# EAGLE design Homefi_10 (EAGLE 7.1.0)
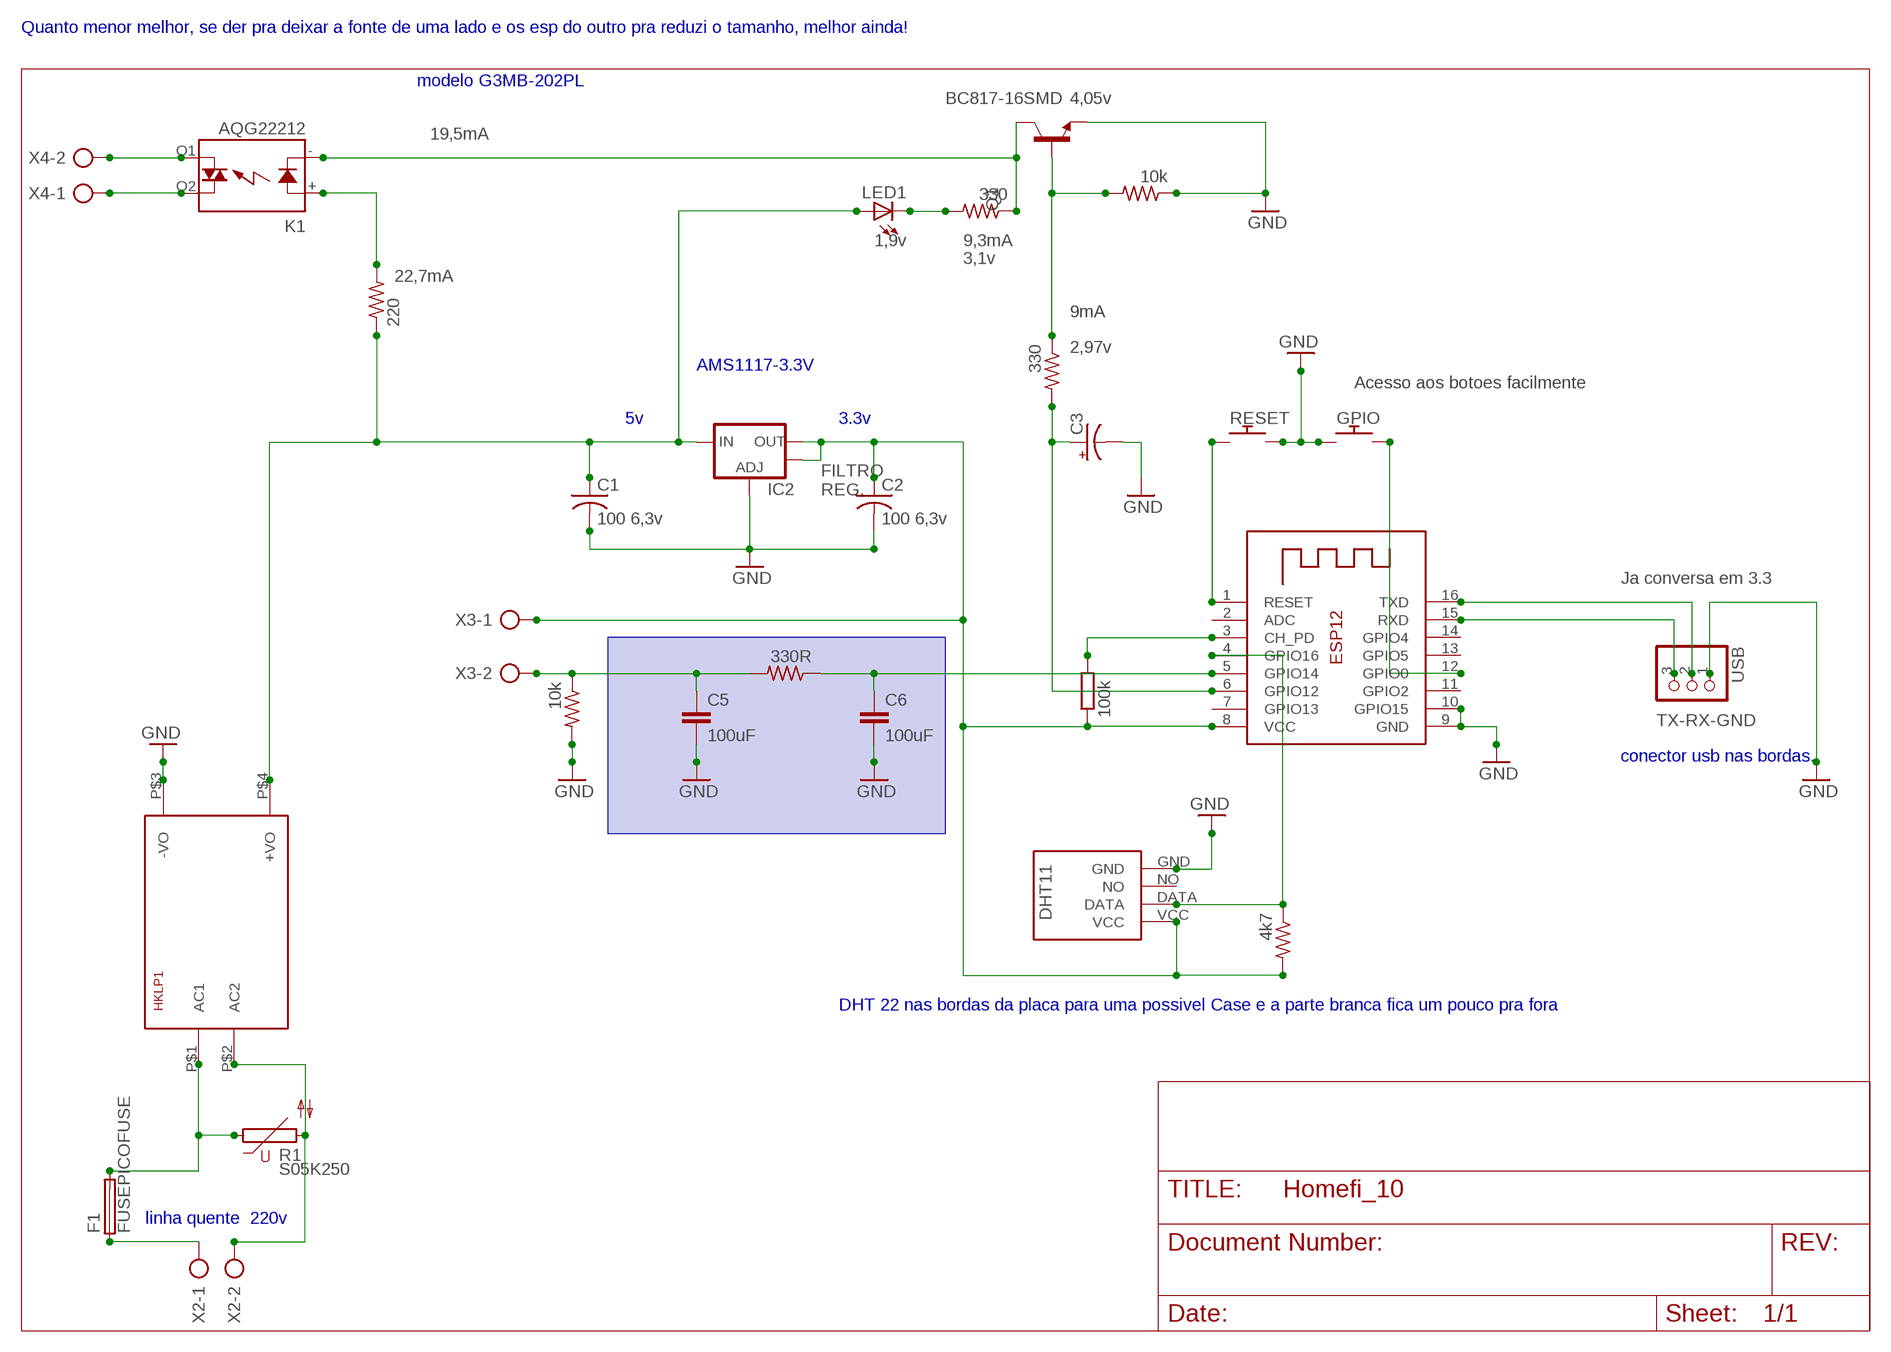
[diagram p0: schematic, sheet 1]

## Parts
1  10k  R-US_M0805  [M0805]
2  10k  R-US_M0805  [M0805]
3  100k  R-EU_M0805  [M0805]
4  330R  R-US_M0805  [M0805]
5  330  R-US_M0805  [M0805]
6  220  R-US_M0805  [M0805]
7  330  R-US_M0805  [M0805]
8  4k7  R-US_M0805  [M0805]
C1  100 6,3v  C-USC0805  [C0805]
C2  100 6,3v  C-USC0805  [C0805]
C3  CPOL-US153CLV-0605  [153CLV-0605]
C5  100uF  C-EUC0805  [C0805]
C6  100uF  C-EUC0805  [C0805]
F1  FUSEPICOFUSE  [PICOFUSE]
GPIO  GPIO  SWITCH_PUSHBUTTONEVQ-PE  [TACT_PANA-EVQ]
HKLP1  HKLPM01  [HKLPM01]
IC2  V_REG_LM1117SOT223  [SOT223]
K1  AQG22212  [AQG]
LED1  LEDCHIPLED_0805  [CHIPLED_0805]
Q1  BC817-16SMD  [SOT23-BEC]
R1  S05K250  [S05K250]
RESET  RESET  SWITCH_PUSHBUTTONEVQ-PE  [TACT_PANA-EVQ]
U$1  DHT11-PION.  [DHT11-PION.]
USB  PINHD-1X3  [1X03]
X2  AK500/2  [AK500/2]
X3  AK500/2  [AK500/2]
X4  AK500/2  [AK500/2]
X5  ESP-12  [ESP-12]

## Nets
2N3904: 5.1 K1.-(K) Q1.C
5V: 6.1 C1.1 HKLP1.P$4(+VO) IC2.3(IN) LED1.A
GND: 1.1 2.2 C1.2 C2.2 C3.- C5.2 C6.2 GPIO.P$1 HKLP1.P$3(-VO) IC2.1(ADJ) Q1.E RESET.P$2 U$1.GND USB.1 X5.9(GND) X5.10(GPIO15)
N$1: K1.O1(DS2) X4.2
N$2: 3.1 8.2 C2.1 IC2.2(OUT) IC2.4(OUT) U$1.VCC X3.1 X5.8(VCC)
N$3: 5.2 LED1.C
N$9: K1.O2(DS1) X4.1
N$10: 6.2 K1.+(A)
N$12: USB.3 X5.15(RXD)
N$15: RESET.P$1 X5.1(RESET)
N$16: F1.1 X2.1
N$17: 1.2 7.1 Q1.B
N$19: F1.2 HKLP1.P$1(AC1) R1.1
N$20: 4.1 C6.1 X5.5(GPIO14)
N$23: 2.1 4.2 C5.1 X3.2
N$24: 3.2 X5.3(CH_PD)
N$25: 7.2 C3.+ X5.6(GPIO12)
N$35: HKLP1.P$2(AC2) R1.2 X2.2
N$41: 8.1 U$1.DATA X5.4(GPIO16)
N$45: GPIO.P$2 X5.12(GPIO0)
N$48: USB.2 X5.16(TXD)
Unconnected: U$1.NO X5.2(ADC) X5.7(GPIO13) X5.11(GPIO2) X5.13(GPIO5) X5.14(GPIO4)

## Notes on the sheet
- Quanto menor melhor, se der pra deixar a fonte de uma lado e os esp do outro pra reduzi o tamanho, melhor ainda!
- modelo G3MB-202PL
- 4,05v
- 19,5mA
- 1,9v | 9,3mA
- 3,1v
- 22,7mA
- 9mA
- 2,97v
- AMS1117-3.3V
- Acesso aos botoes facilmente
- 5v | 3.3v
- FILTRO
  REG.
- Ja conversa em 3.3
- TX-RX-GND
- conector usb nas bordas.
- DHT 22 nas bordas da placa para uma possivel Case e a parte branca fica um pouco pra fora
- linha quente  220v

## Library data of the parts
1 2 4-8 = adafruit:R-US_: RESISTOR, American symbol
3 = rcl:R-EU_: RESISTOR, European symbol
C1 C2 = adafruit:C-US: CAPACITOR, American symbol
C3 = rcl:CPOL-US: POLARIZED CAPACITOR, American symbol
C5 C6 = rcl:C-EU: CAPACITOR, European symbol
F1 = fuse:FUSE: Fuse; OC_FARNELL: unknown; OC_NEWARK: unknown
GPIO RESET = adafruit:SWITCH_PUSHBUTTON: Buttons SOFTTOUCHSMD_SJ - Soft touch temporary push button (Super Junk Akihabara) Compatible with SKPMANE010 [Mouser: 688-SKPMAN] C&K_KSS = Digikey: KSS221GLFS
HKLP1 = HKLPM01:HKLPM01
IC2 = SparkFun-PowerIC:V_REG_LM1117: Voltage Regulator LM1117 Standard adjustable voltage regulator but in SMD form. Spark Fun Electronics SKU : COM-00595
K1 = relay-omron:AQG*: SOLID STATE RELAY NAiS Zero-cross, Non zero-cross Source: http://www.mew-europe.com/.. en_ds_61611_0000.pdf; MPN: AQG22212; OC_FARNELL: unknown; OC_NEWARK: 11N2588
LED1 = adafruit:LED: LED OSRAM: - CHIPLED LG R971, LG N971, LY N971, LG Q971, LY Q971, LO R971, LY R971 LH N974, LH R974 LS Q976, LO Q976, LY Q976 LO Q996 - Hyper CHIPLED LW Q18S LB Q993, LB Q99A, LB R99A - SideLED LS A670, LO A670, LY A670, LG A670, LP A670 LB A673, LV A673, LT A673, LW A673 LH A674 LY A675 LS A676, LA A676, LO A676, LY A676, LW A676 LS A679, LY A679, LG A679 - Hyper Micro SIDELED® LS Y876, LA Y876, LO Y876, LY Y876 LT Y87S - SmartLED LW L88C, LW L88S LB L89C, LB L89S, LG L890 LS L89K, LO L89K, LY L89K LS L896, LA L896, LO L896, LY L896 - TOPLED LS T670, LO T670, LY T670, LG T670, LP T670 LSG T670, LSP T670, LSY T670, LOP T670, LYG T670 LG T671, LOG T671, LSG T671 LB T673, LV T673, LT T673, LW T673 LH T674 LS T676, LA T676, LO T676, LY T676, LB T676, LH T676, LSB T676, LW T676 LB T67C, LV T67C, LT T67C, LS T67K, LO T67K, LY T67K, LW E67C LS E67B, LA E67B, LO E67B, LY E67B, LB E67C, LV E67C, LT E67C LW T67C LS T679, LY T679, LG T679 LS T770, LO T770, LY T770, LG T770, LP T770 LB T773, LV T773, LT T773, LW T773 LH T774 LS E675, LA E675, LY E675, LS T675 LS T776, LA T776, LO T776, LY T776, LB T776 LHGB T686 LT T68C, LB T68C - Hyper Mini TOPLED® LB M676 - Mini TOPLED Santana® LG M470 LS M47K, LO M47K, LY M47K Source: http://www.osram.convergy.de/
Q1 = transistor-npn:BC817*: NPN Transistor
R1 = varistor:S05K250: VARISTOR
U$1 = DHT11:DHT11-PION.: DHT11 Czujnik temperatury i wilgotności (widok pionowy)
USB = adafruit:PINHD-1X3: PIN HEADER
X2-X4 = con-ptr500:AK500/2: CONNECTOR; OC_FARNELL: unknown; OC_NEWARK: unknown
X5 = adafruit:ESP-12

## Board
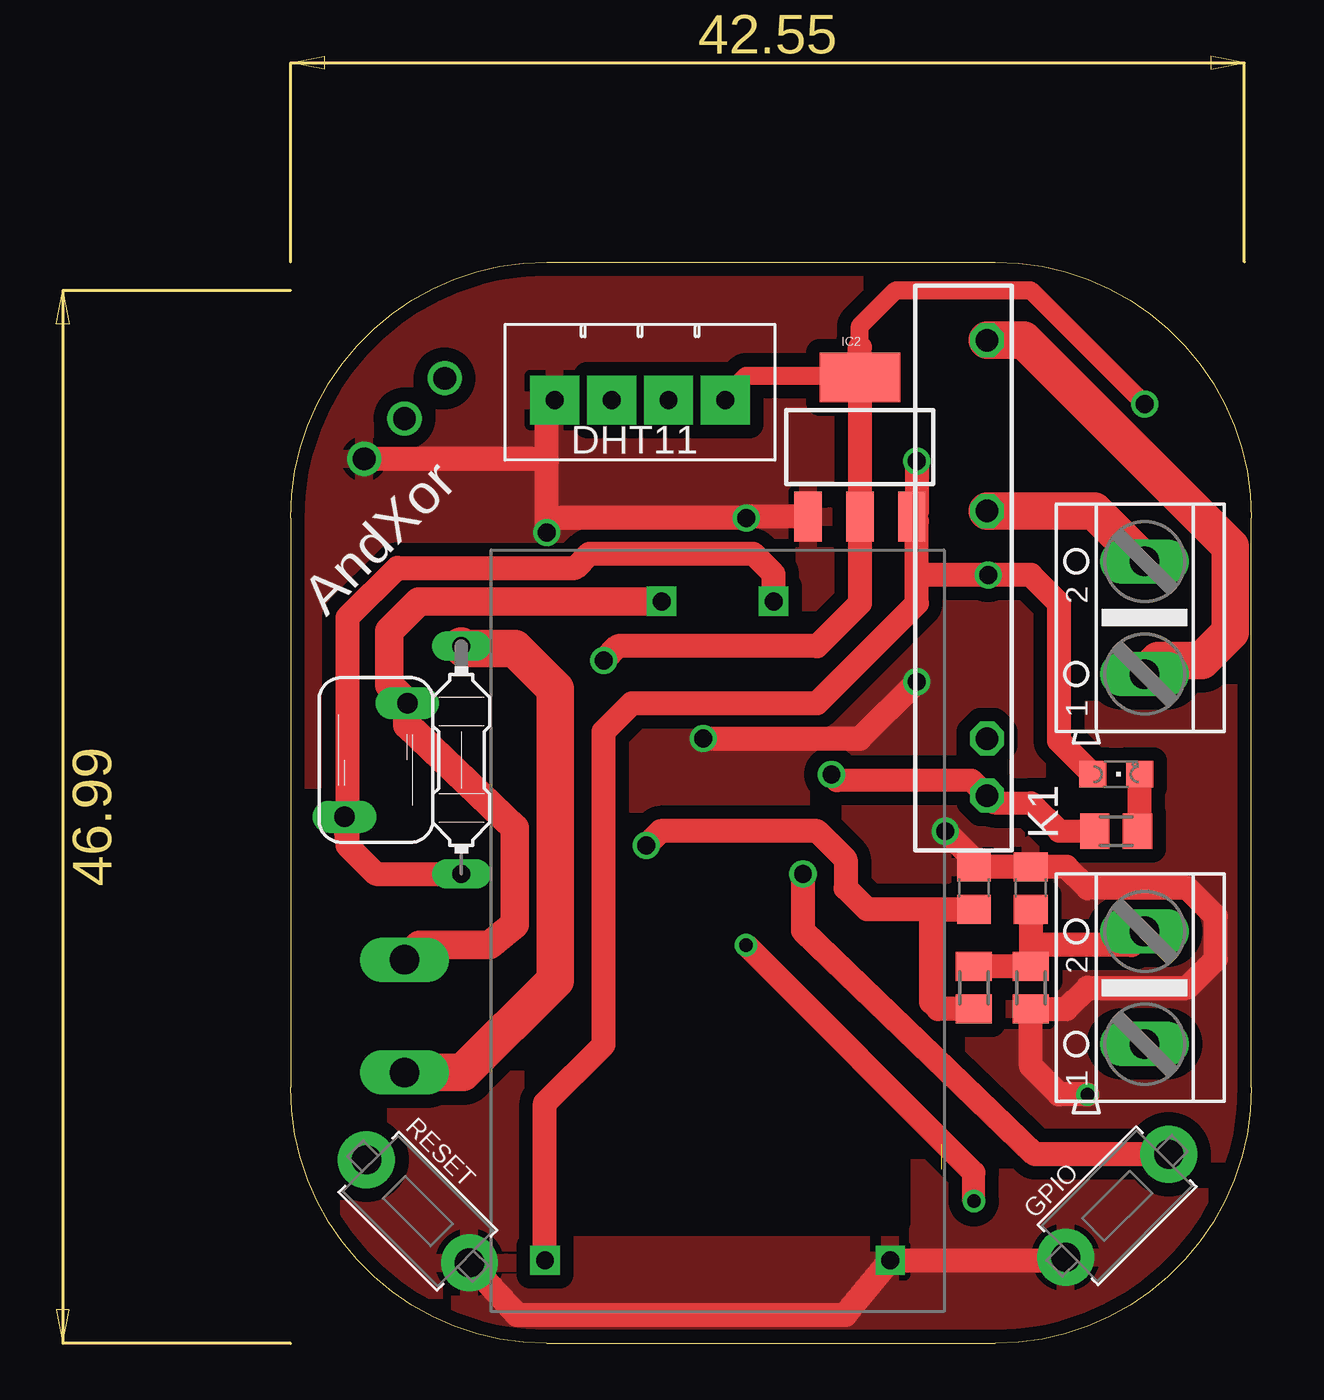
[diagram p1: board, top side]
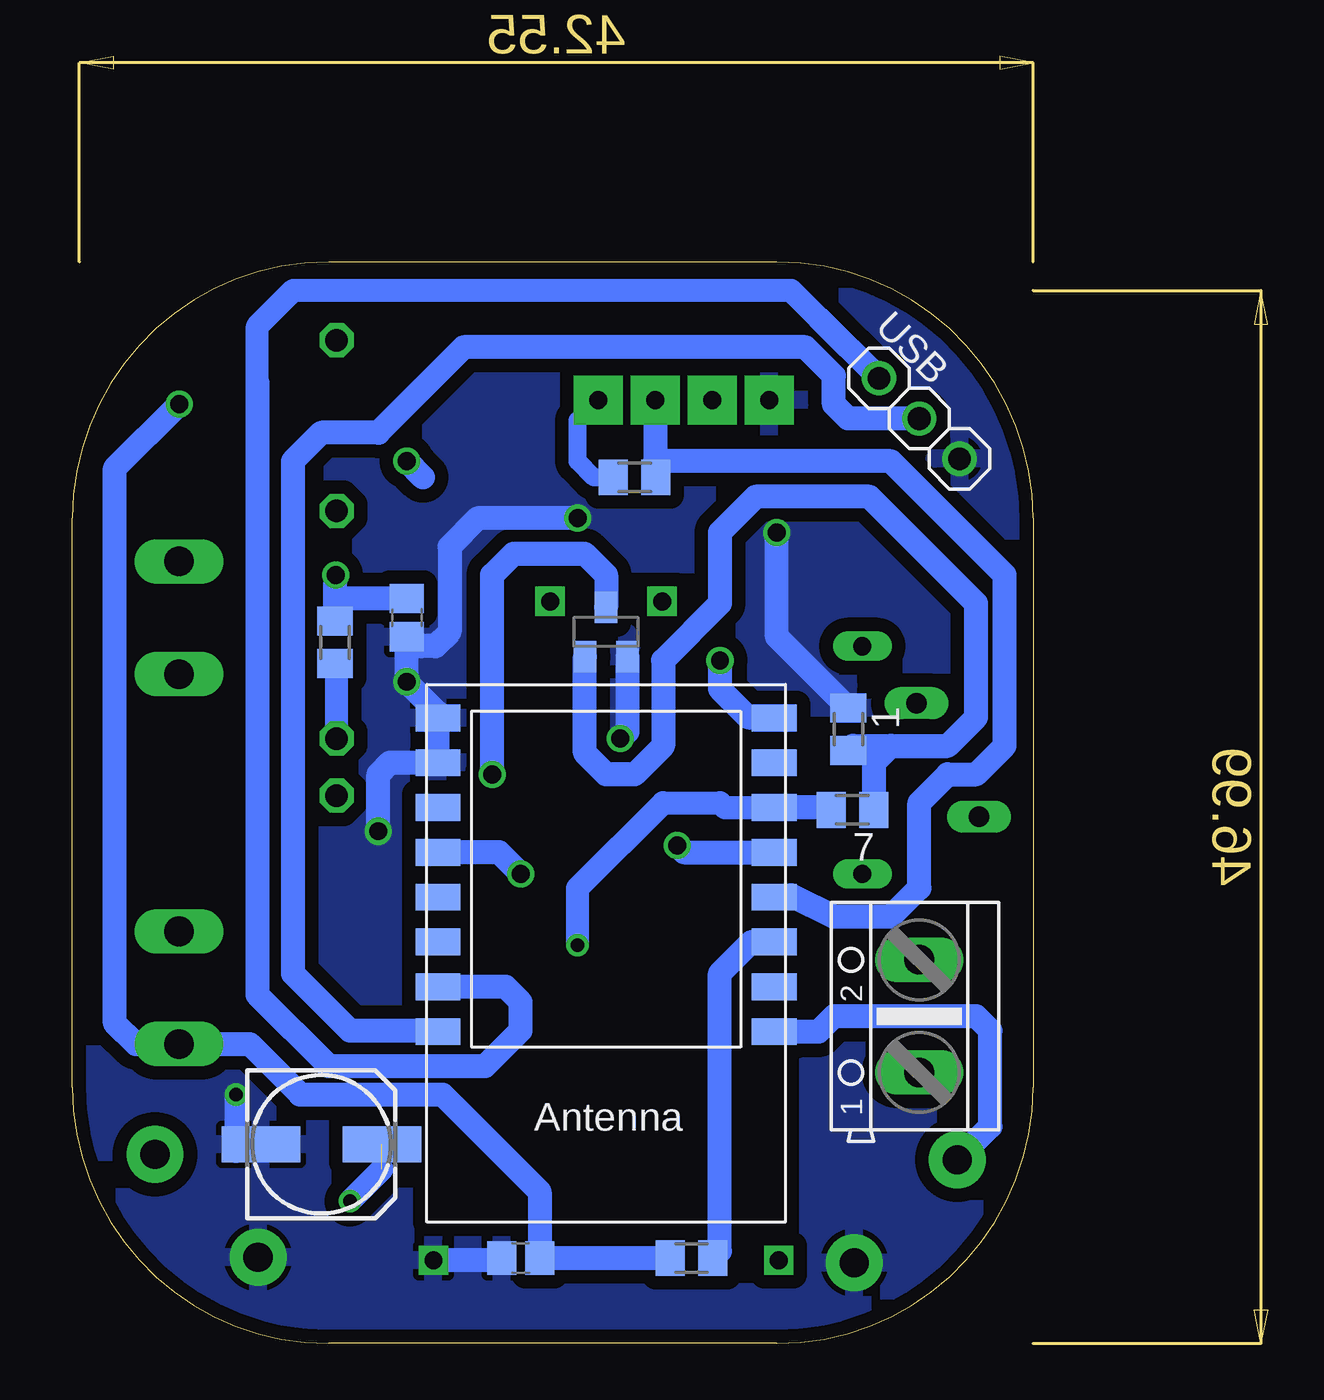
[diagram p2: board, bottom side, seen from below]

Size 42.86 x 48.26 mm. Coordinates in mm from the lower left corner, seen from the top.
Outline: 0,36.83 arc-90 11.43,48.26 31.43,48.26 arc-90 42.86,36.83 42.86,11.43 arc-90 31.43,0 11.43,0 arc-90 0,11.43 0,36.83
Copper layers (1*16): Top 0.035mm / dielectric 1.5mm / Bottom 0.035mm
Design rules "Modulo_Versão_466 (1) *": minimum track width 1mil, minimum drill 24mil, track to track 8mil, track to pad 8mil, pad to pad 8mil, via to via 0.205mm, smd to smd 8mil, copper to edge 2mil, drill to drill 4mil, minimum pad ring 10mil, minimum via ring 8mil, stop-mask expansion 4mil, vias tented up to drill 0mil, thermal gap 10mil

### Footprints (pad centres in the part's own frame; a part is rotated, then mirrored left to right if it is on the bottom)
M0805 = smd 1.3 x 1.6: 1 -0.95,0; 2 0.95,0
C0805 = smd 1.3 x 1.5: 1 -0.85,0; 2 0.85,0
153CLV-0605 = smd 3.5 x 1.6: + 2.7,0; - -2.7,0
C0805' = smd 1.3 x 1.5: 1 -0.95,0; 2 0.95,0
PICOFUSE = drill 0.813 long: 1 -5.08,0; 2 5.08,0
TACT_PANA-EVQ = drill 1.3 pad 2.54: P$1 -3.25,0; P$2 3.25,0
HKLPM01 = drill 0.8 square: P$1 -14.7,2.5; P$2 -14.7,-2.5; P$3 14.7,7.7; P$4 14.7,-7.7
SOT223 = smd 1.219 x 2.235: 1 -2.311,-3.099; 2 0,-3.099; 3 2.311,-3.099 | smd 3.6 x 2.2: 4 0,3.099
AQG = drill 1 octagon: + -7.62,0; - -10.16,0; O1 2.54,0; O2 10.16,0
CHIPLED_0805 = smd 1.2 x 1.2: A 0,-1.05; C 0,1.05
SOT23-BEC = smd 1 x 1.4: B -0.95,-1.1; C 0,1.1; E 0.95,-1.1
S05K250 = drill 0.914 long: 1 -1.397,-2.54; 2 1.397,2.54
DHT11-PION. = drill 0.8 pad 2.184 square: DATA -1.27,0.305; GND 3.81,0.305; NO 1.27,0.305; VCC -3.81,0.305
1X03 = drill 1.016: 1 -2.54,0; 2 0,0; 3 2.54,0
AK500/2 = drill 1.321 long: 1 -2.515,0; 2 2.515,0
ESP-12 = smd 2 x 1.2: 1 -7.5,4.5; 2 -7.5,2.5; 3 -7.5,0.5; 4 -7.5,-1.5; 5 -7.5,-3.5; 6 -7.5,-5.5; 7 -7.5,-7.5; 8 -7.5,-9.5; 9 7.5,-9.5; 10 7.5,-7.5; 11 7.5,-5.5; 12 7.5,-3.5; 13 7.5,-1.5; 14 7.5,0.5; 15 7.5,2.5; 16 7.5,4.5

### Placement (x,y rotation side)
1  8.24,27.41 270 bottom
2  33.02,15.88 270 top
3  15.24,3.81 0 bottom
4  30.48,15.88 90 top
5  36.83,22.86 0 top
6  31.14,31.29 270 bottom
7  8.06,23.81 180 bottom
8  17.78,38.65 180 bottom
C1  27.94,32.38 270 bottom
C2  22.86,3.81 180 bottom
C3  31.75,8.89 0 bottom
C5  100uF  [C0805']  33.02,20.32 90 top
C6  100uF  [C0805']  30.48,20.32 90 top
F1  7.62,26.04 270 top
GPIO  36.87,6.14 45 top
HKLP1  19.05,18.41 270 top
IC2  25.4,40.01 0 top
K1  31.07,34.61 90 top
LED1  36.83,25.4 270 top
Q1  19.05,31.75 0 bottom
R1  3.81,26.04 0 top
RESET  5.68,5.9 315 top
U$1  15.59,42.41 180 top
USB  5.08,41.27 135 bottom
X2  5.08,14.61 90 bottom
X3  38.1,15.88 90 top
X4  38.1,32.38 90 top
X5  19.05,18.41 180 bottom

### Tracks (layer width: path | path; a pad name or v marks a point on that pad's centre or on a via)
2N3904  (via drill 0.8)
  Top 1.016: 24.39,25.14 30.38,25.14 K1.- 31.39,24.13 33.02,24.13 34.29,22.86 5.1
  Top 1.067: 5.1 35.56,22.86 | 24.39,25.14 v24.13,25.4
  Bottom 1.067: v24.13,25.4 24.13,34.29 23.18,35.24 20,35.24 19.05,34.29 Q1.C
5V  (via drill 0.8)
  Top 1.067: HKLP1.P$4 11.35,10.71 13.97,13.34 13.97,27.3 15.24,28.57 23.5,28.57 27.94,33.02 27.94,34.29 | 27.94,34.29 27.94,36.68 IC2.3 27.94,37.13 v27.94,39.37 | LED1.A 34.29,26.89 34.29,33.02 33.02,34.29 v31.11,34.29 27.94,34.29
  Bottom 1.067: 27.22,38.65 v27.94,39.37 | v31.11,34.29 31.14,33.63 6.1 30.87,33.23 C1.1
GND  (via drill 0.6, 0.8)
  Top 1.067: RESET.P$2 10.09,1.27 24.75,1.27 HKLP1.P$3 34.44,3.71 GPIO.P$1 | v35.56,11.11 34.29,11.11 33.02,12.38 2.2 34.61,14.93 35.56,15.88 40.01,15.88 41.27,17.14 41.27,19.05 40.01,20.32 35.56,20.32 34.61,21.27 C5.2 C6.2 30.48,21.59 v29.21,22.86 | IC2.1 20.4,36.91 v20.32,36.83 11.43,36.83 | 11.43,36.83 11.43,39.37 | 11.43,39.37 11.43,41.76 U$1.GND | USB.1 11.32,39.48 11.43,39.37 | v18.41,26.99 25.4,26.99 v27.94,29.53 | v11.43,36.2 11.43,36.83
  Bottom 1.016: v35.56,11.11 35.56,8.57 | 34.45,3.85 GPIO.P$1
  Bottom 1.067: C2.2 23.8,3.71 HKLP1.P$3 | v20.32,36.83 24.77,36.83 26.04,35.56 26.04,31.75 26.67,31.11 27.3,31.11 C1.2 v27.94,29.53 26.55,28.14 X5.9 X5.10 28.7,25.91 29.21,25.4 v29.21,22.86 | Q1.E 18.1,27.31 v18.41,26.99 | 1.1 11.43,31.55 v11.43,36.2
  pour Top (isolate 0.61): 11.43,0 arc-90 0,11.43 0,36.83 arc-96 12.7,48.26 30.48,48.26 arc-90 43.18,35.56 43.18,12.7 arc-90 30.48,0
  pour Bottom (isolate 0.61): 0,36.83 arc-90 11.43,48.26 31.75,48.26 arc-90 43.18,36.83 43.18,11.43 arc-96 30.48,0 11.43,0 arc-90 0,11.43
N$1
  Top 1.676: K1.O1 35.85,37.15 X4.2
N$2  (via drill 0.8)
  Top 0.813: U$1.VCC 19.4,42.26 20.32,43.18 25.32,43.18 IC2.4 | 25.4,44.45 25.4,45.4 27,47 33.01,47 v38.1,41.91
  Top 1.067: v13.97,30.48 14.61,31.11 23.5,31.11 25.4,33.02 IC2.2 IC2.4 25.4,44.45
  Bottom 0.813: 11.57,27.94 X5.8 | 8.2 19.6,38.65 20.32,39.37 20.32,41.19 U$1.VCC
  Bottom 1.067: v13.97,30.48 13.97,29.21 12.7,27.94 11.57,27.94 | 3.1 C2.1 22.01,6.77 26.35,11.11 32.7,11.11 34.95,13.36 X3.1 40.03,13.36 40.96,14.29 40.96,39.05 v38.1,41.91
N$3
  Top 1.067: 5.2 37.88,22.96 LED1.C
N$9
  Top 1.676: K1.O2 32.7,44.77 41.91,35.56 41.91,31.75 40.64,30.48 38.71,30.48 X4.1
N$10
  Bottom 1.016: K1.+ 31.07,30.26 6.2
N$12
  Bottom 1.016: 34.61,42.86 34.61,45.39 33,47 10.8,47 9.53,45.72
  Bottom 1.067: USB.3 9.53,45.72 | X5.15 23.54,15.91 22.86,15.24 22.86,13.97 24.45,12.38 31.43,12.38 34.61,15.56 34.61,42.86
N$15
  Bottom 1.067: RESET.P$1 1.91,9.68 1.91,13.97 2.54,14.61 8.89,14.61 9.58,13.91 X5.1
N$16
  Top 1.676: X2.1 7.69,12.09 11.8,16.2 11.8,29.2 10,31 7.74,31 F1.1
N$17
  Bottom 1.067: 6.35,26.67 3.81,26.67 2.54,27.94 2.54,33.02 7.3,37.78 12.38,37.78 13.97,36.2 13.97,33.02 16.51,30.48 16.51,26.67 17.78,25.4 19.05,25.4 20,26.35 Q1.B | 1.2 8.03,26.67 6.35,26.67 | 6.35,26.67 7.11,25.91 7.1
N$19
  Top 1.067: HKLP1.P$1 21.55,34.33 20.64,35.24 13.34,35.24 12.7,34.61 4.76,34.61 2.54,32.38 2.54,22.35 | 2.54,22.35 R1.1 | 2.54,22.35 2.54,22.23 3.81,20.95 F1.2
N$20  (via drill 0.8)
  Top 1.067: 4.1 28.89,14.93 28.57,15.24 28.57,19.05 28.89,19.37 C6.1 25.71,19.37 24.77,20.32 24.77,21.59 23.5,22.86 16.51,22.86 v15.88,22.23
  Bottom 1.067: v15.88,22.23 15.56,21.91 X5.5
N$23
  Top 1.067: C5.1 33.02,17.78 | 33.02,17.78 2.1 4.2 | X3.2 37.51,17.78 33.02,17.78
N$24
  Bottom 1.067: 3.2 13.97,4.13 13.97,16.51 12.56,17.91 X5.3
N$25  (via drill 0.6)  (1 unrouted)
  Top 1.016: v30.48,6.35 30.48,7.62 v20.32,17.78
  Bottom 1.016: 29.05,7.78 v30.48,6.35 | v20.32,17.78 20.32,20.32 16.51,24.13 13.97,24.13 13.76,23.91 X5.6
  Bottom 1.067: 7.2 9.12,23.91 X5.6
N$35
  Top 1.27: HKLP1.P$2 5.71,33.12 4.4,31.8 4.4,29.38 R1.2 5.21,27.59 10,23 10,18.69 8.89,17.78 5.74,17.78 X2.2
N$41
  Bottom 1.067: U$1.DATA 16.86,39.37 | 16.86,39.37 16.86,38.68 8.1 | X5.4 10.79,20 8.89,19.05 6.35,19.05 5.08,20.32 5.08,24.13 3.81,25.4 2.54,25.4 1.27,26.67 1.27,34.29 6.35,39.37 16.86,39.37
N$45  (via drill 0.8)
  Top 1.067: GPIO.P$2 33.21,8.44 22.86,18.41 v22.86,20.95
  Bottom 1.067: v22.86,20.95 23.82,21.91 X5.12
N$48
  Bottom 1.067: USB.2 8.26,41.27 8.89,41.91 8.89,43.18 10.16,44.45 25.4,44.45 29.21,40.64 31.75,40.64 33.02,39.37 33.02,16.51 30.48,13.97 26.61,13.97 X5.16 26.5,13.97

### Text on the board
tPlace: AndXor